# EAGLE design Laptimer (EAGLE 6.3)
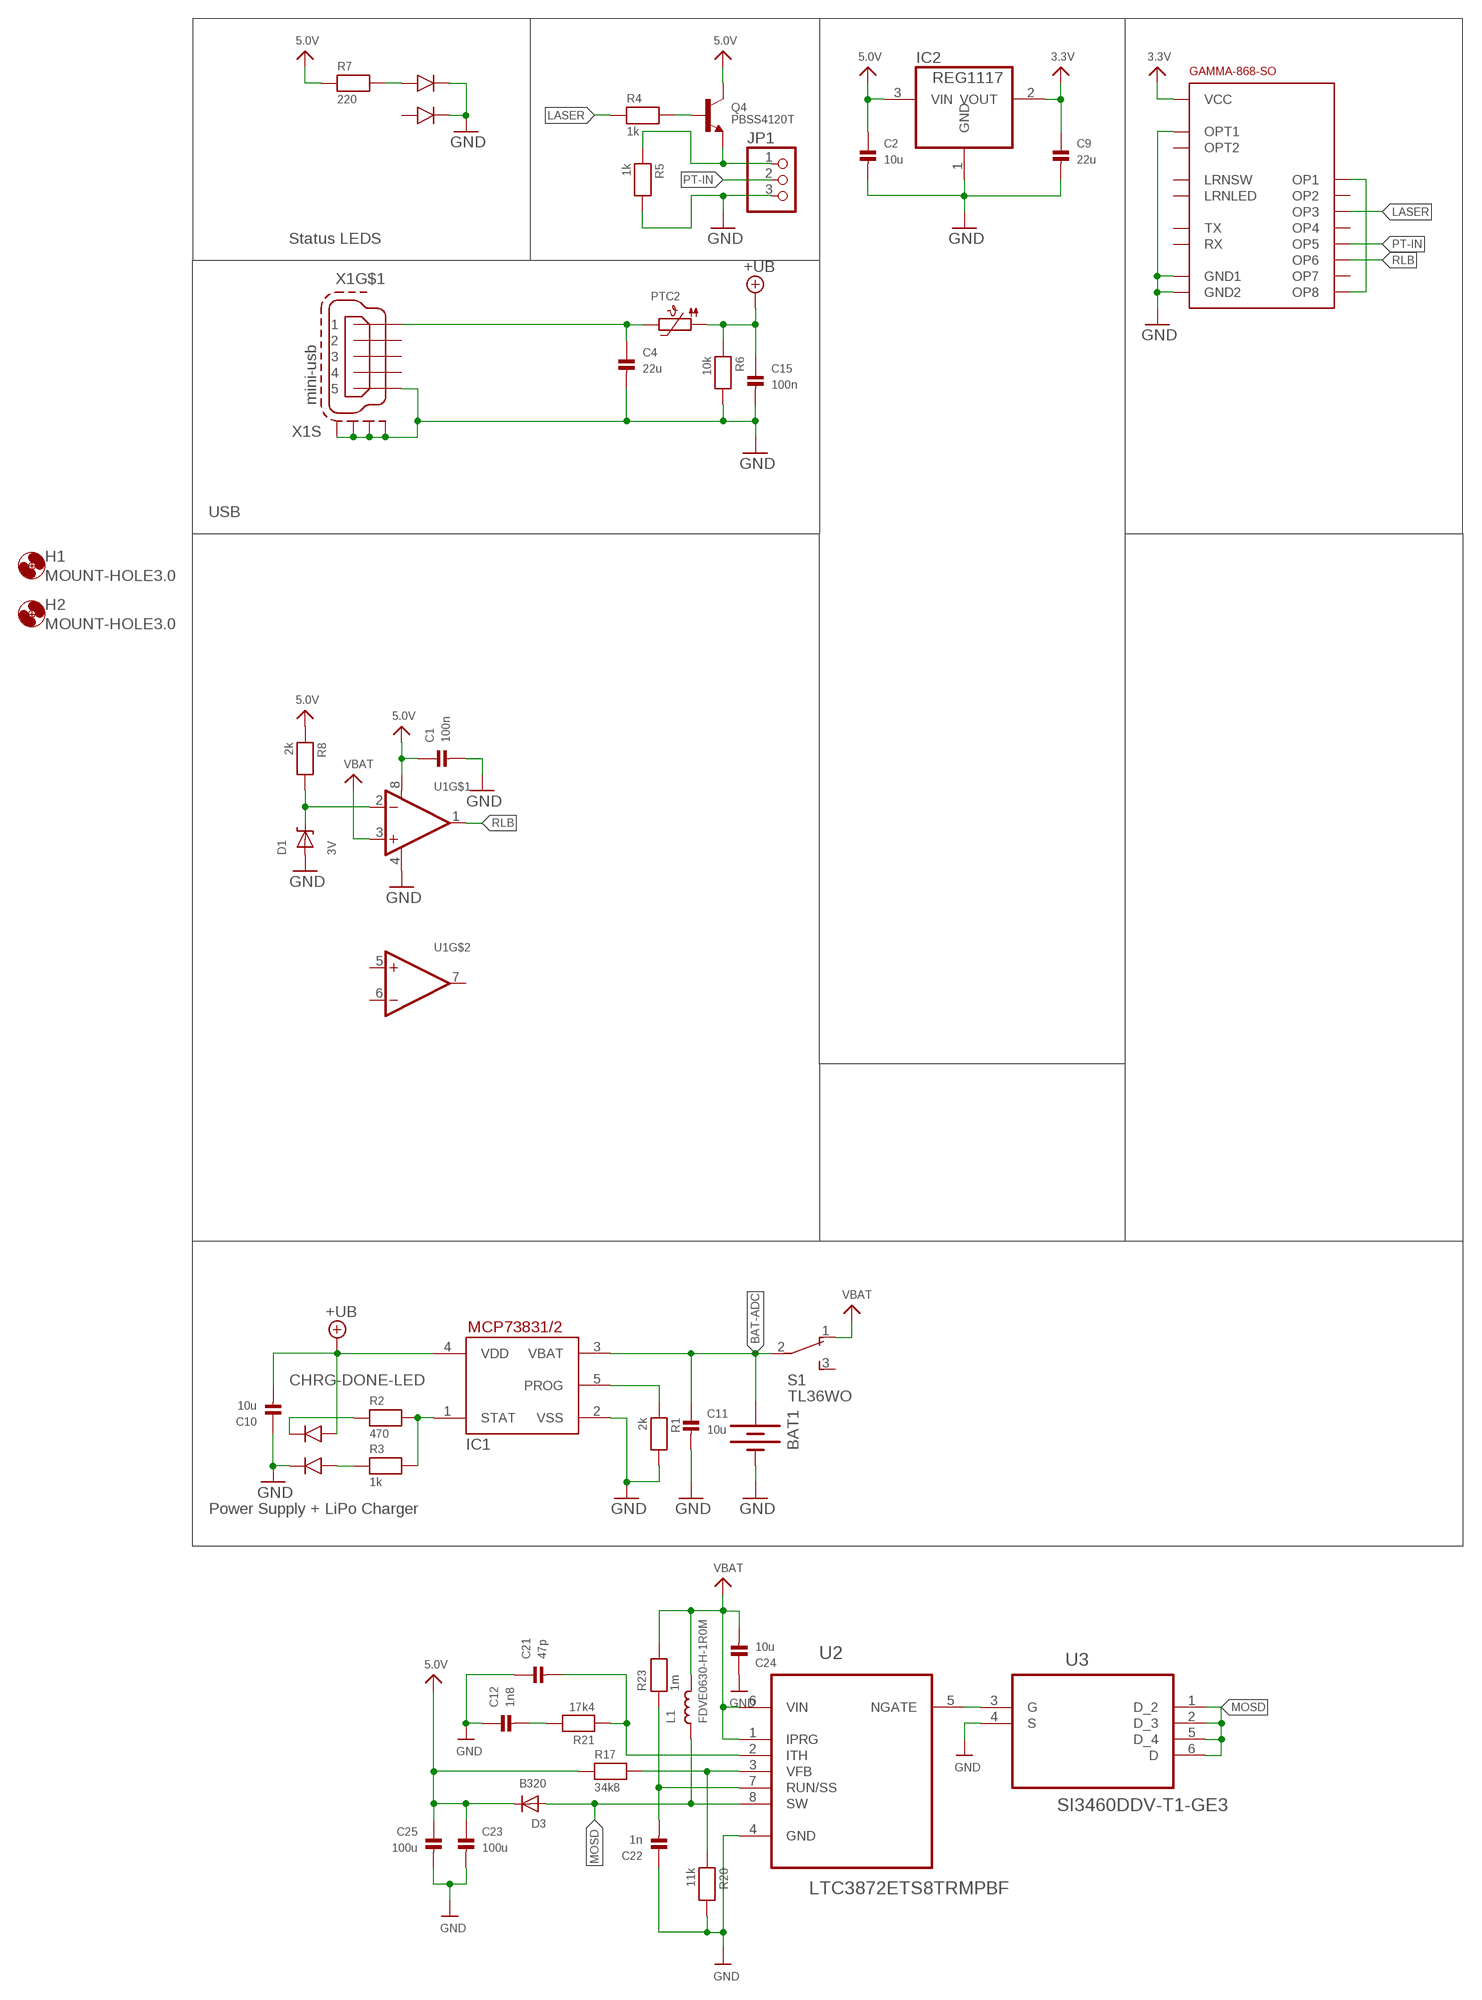
[diagram p0: schematic, sheet 1]

## Parts
BAT1  BATTERY18650  [BATTERY_18650-HOLDER]
C1  100n  CAP_CERAMIC_0603  [_0603]
C2  10u  CAP_CERAMIC_0805  [_0805]
C4  22u  CAP_CERAMIC_0805  [_0805]
C9  22u  CAP_CERAMIC_0805  [_0805]
C10  10u  CAP_CERAMIC_0805  [_0805]
C11  10u  CAP_CERAMIC_0805  [_0805]
C12  1n8  CAP_CERAMIC_0603  [_0603]
C15  100n  CAP_CERAMIC_0603  [_0603]
C21  47p  CAP_CERAMIC_0603  [_0603]
C22  1n  CAP_CERAMIC_0603  [_0603]
C23  100u  CAP_CERAMIC1206  [1206]
C24  10u  CAP_CERAMIC_0805  [_0805]
C25  100u  CAP_CERAMIC1206  [1206]
D1  3V  DIODE-ZENER  [SMADIODE]
D3  B320  DIODESMA  [SMADIODE]
H1  MOUNT-HOLE3.0  [3,0]
H2  MOUNT-HOLE3.0  [3,0]
IC1  MCP73831/OT  [SOT23-5L]
IC2  REG1117  [SOT223]
JP1  PINHD-1X3  [1X03]
L1  FDVE0630-H-1R0M  INDUCTORTDK_SLF6045  [INDUCTOR_6X6MM_TDK_SLF6045]
PTC2  PTC1206  [1206]
Q4  PBSS4120T  TRANSISTOR_NPNWIDE  [SOT23-WIDE]
R1  2k  RESISTOR_0603  [_0603]
R2  470  RESISTOR_0603  [_0603]
R3  1k  RESISTOR_0603  [_0603]
R4  1k  RESISTOR_0603  [_0603]
R5  1k  RESISTOR_0603  [_0603]
R6  10k  RESISTOR_0603  [_0603]
R7  220  RESISTOR_0603  [_0603]
R8  2k  RESISTOR_0603  [_0603]
R17  34k8  RESISTOR_0603  [_0603]
R20  11k  RESISTOR_0603  [_0603]
R21  17k4  RESISTOR_0603  [_0603]
R23  1m  RESISTOR_0603  [_0603]
S1  TL36WO  [TL3XWO]
U1  LM358  [SOIC8_150MIL]
U2  LTC3872ETS8TRMPBF  [SOT65P280X100-8N]
U3  SI3460DDV-T1-GE3  SI3457CDV-T1-GE3  [SOT95P285X110-6N]
U$7  GAMMA-868-SO  [UNICORN_V2_GAMMA-868-SO]
U$13  BI-LEVEL-LED-INDICATOR  [BI-LEVEL-LED-INDICATOR]
U$14  BI-LEVEL-LED-INDICATOR  [BI-LEVEL-LED-INDICATOR]
X1  mini-usb  MINI-USB-SCHIELD-32005-301  [32005-301]

## Nets
3.3V: C9.1 IC2.2(VOUT) U$7.P$16(VCC)
5.0V: C1.1 C2.1 C23.1 C25.1 D3.C IC2.3(VIN) Q4.3(C) R7.1 R8.1 R17.1 U1.8(V+)
+UB: C10.2 C15.1 IC1.4(VDD) PTC2.1 R6.1 U$13.ANODE1
BAT-ADC: BAT1.PWR@1(+) C11.1 IC1.3(VBAT) S1.2(P)
CHRG-DONE-LED: R3.1 U$13.ANODE2
CT: U$7.P$3(OP1) U$7.P$13(OP8)
GND: BAT1.GND@1(-) C1.2 C2.2 C4.2 C9.2 C10.1 C11.2 C12.1 C15.2 C21.1 C22.1 C23.2 C24.1 C25.2 D1.A IC1.2(VSS) IC2.1(GND) JP1.3 R1.2 R5.2 R6.2 R20.2 U1.4(V-) U2.4(GND) U3.4(S) U$7.P$2(GND1) U$7.P$10(OPT1) U$7.P$15(GND2) U$13.CATHODE2 U$14.CATHODE1 U$14.CATHODE2 X1.5 X1.M1(S:S1) X1.M2(S:S2) X1.M3(S:S3) X1.M4(S:S4)
LASER: R4.1 U$7.P$7(OP3)
MOSD: D3.A L1.P$1 U2.8(SW) U3.1(D_2) U3.2(D_3) U3.5(D_4) U3.6(D)
N$1: R17.2 R20.1 U2.3(VFB)
N$2: C12.2 R21.2
N$3: IC1.5(PROG) R1.1
N$4: IC1.1(STAT) R2.2 R3.2
N$5: JP1.1 Q4.2(E) R5.1
N$6: Q4.1(B) R4.2
N$7: D1.C R8.2 U1.2(-IN)
N$8: U2.5(NGATE) U3.3(G)
N$13: C4.1 PTC2.2 X1.1
N$14: R2.1 U$13.CATHODE1
N$27: C21.2 R21.1 U2.2(ITH)
N$29: C22.2 R23.1 U2.7(RUN/SS)
N$32: R7.2 U$14.ANODE2
PT-IN: JP1.2 U$7.P$9(OP5)
RLB: U1.1(OUT) U$7.P$11(OP6)
VBAT: C24.2 L1.P$2 R23.2 S1.1(O) U1.3(+IN) U2.1(IPRG) U2.6(VIN)
Unconnected: S1.3(S) U1.5(+IN) U1.6(-IN) U1.7(OUT) U$7.P$4(OP2) U$7.P$5(LRNSW) U$7.P$6(LRNLED) U$7.P$8(OP4) U$7.P$12(OP7) U$7.P$14(OPT2) U$7.P$17(TX) U$7.P$18(RX) U$14.ANODE1 X1.2 X1.3 X1.4

## Notes on the sheet
- Status LEDS
- USB
- Power Supply + LiPo Charger

## Library data of the parts
BAT1 = SparkFun-Electromechanical:BATTERY: Battery Holders Various common sizes : AA, AAA, 18650 (PRT-12895), 20mm coin cell and 12mm coin cell. 20MM_4LEGS, BATT-10373
C1 C2 C4 C9-C12 C15 C21-C25 = microbuilder:CAP_CERAMIC: Ceramic Capacitors 0402 - 0402 Surface Mount Capacitors 16pF 50V 5% [Digikey: 445-4899-2-ND] 18pF 50V 5% [Digikey: 490-1281-2-ND] 22pF 50V 5% [Digikey: 490-1283-2-ND] 68pF 50V 5% [Digikey: 490-1289-2-ND] 0.1uF 10V 10% [Digikey: 490-1318-2-ND] 1.0uF 6.3V 10% [Digikey: 490-1320-2-ND] 0603 - 0603 Surface Mount Capacitors 16 pF 50V 5% [Digikey: 445-5051-2-ND] 22 pF 50V [Digikey: PCC220ACVTR-ND] 33 pF 50V 5% [Digikey: 490-1415-1-ND] 56pF 50V 5% [Digikey: 490-1421-1-ND] 220pF 50V 5% [Digikey: 445-1285-1-ND] 680 pF 50V 2200 pF 50V 5% C0G [Digikey: 445-1297-1-ND] 5600 pF 100V 5% X7R [Digikey: 478-3711-1-ND] 0.1 µF 25V 10% [Digikey: PCC2277TR-ND] 0.22 µF 16V 10% X7R [Digikey: 445-1318-1-ND] 1.0 µF 25V 10% [Digikey: 445-5146-2-ND] 0603 - RF Specific 3pF 250V +/-0.1pF RF [Digikey: 712-1347-1-ND] 18 pF 250V 5% [Digikey: 478-3505-1-ND or 712-1322-1-ND] 56 pF 250V 5% C0G RF [Digikey: 490-4867-1-ND] 68 pF 250V RF [Digikey: 490-4868-1-ND] 0805 - 0805 Surface Mount Capacitors 220 pF 250V 2% RF Ceramic Capacitor [Digikey: 712-1398-1-ND] 1000 pF 50V 2% NP0 Ceramic Capacitor [Digikey: 478-3760-1-ND] 0.1 µF 25V 10% Ceramic Capacitor [Digikey: PCC1828TR-ND] 1.0 µF 16V 10% Ceramic Capacitor[Digikey: 490-1691-2-ND] 10.0 µF 10V 10% Ceramic Capacitor[Digikey: 709-1228-1-ND] 10.0 uF 16V 10% Ceramic Capacitor [Digikey: 478-5165-2-ND] 47 uF 6.3V 20% Ceramic Capacitor [Digikey: 587-1779-1-ND or 399-5506-1-ND] 1206 - 1206 Surface Mount Capacitors 47uF 10V 20% Ceramic Capacitor [Digikey: 490-5528-1-ND or 399-5508-1-ND or 445-6010-1-ND] 100uF 6.3V -20%, +80% Y5V Ceramic Capacitor (Digikey: 490-4512-1-ND, Mouser: 81-GRM31CF50J107ZE1L)
D1 = microbuilder:DIODE-ZENER: Zener Diode SMA: 30V 1W Zener Diode, 1.2Vf - Digikey: SMAZ30-FDICT-ND
D3 = adafruit:DIODE: Diode SMADIODE - SMA Surface Mount Package 20V 1A Schottky Diode Digikey: 641-1014-6-ND DO-1N4148 - Through Hole Small Current Diode SOD-123 20V 1 A (.5mV Vf) Schottky Diode - Digikey: MBRX120TPMSCT-ND SOD-323 10V 570mA (.38mV Vf, 3ns) Schottky Diode - Digikey: ZLLS410CT-ND SOD-523 30V 30mA Schottky Diode (RB751S-40TE61) - Digikey: RB751S-40TE61CT-ND SOT23-R/W - SOT23 Package (R = Solder Paste/Reflow Ovens, W = Hand-Soldering) BAT54Film 40V 300mA - Digikey: 497-7162-1-ND
H1 H2 = holes:MOUNT-HOLE: MOUNTING HOLE with drill center marker
IC1 = adafruit:MCP73831: MCP73831/2 Miniature Single-Cell, Fully Integrated Li-Ion, Li-Polymer Charge Management Controllers. Nice and small simple lipoly charge controller, with adjustable current and status output (LED) http://www.ladyada.net/library/pcb/eaglelibrary.html
IC2 = burr-brown:REG1117: 800mA and 1A Low Dropout (LDO) Positive Regulator 1.8V, 2.5V, 2.85V, 3.3V, 5V, and Adj; MPN: REG1117; OC_FARNELL: 1097566; OC_NEWARK: 14P6981
JP1 = adafruit:PINHD-1X3: PIN HEADER
L1 = microbuilder:INDUCTOR: Inductors 0603: 10nH Ceramic Inductor - microwire antenna/RF (Digikey: 712-1434-2-ND) 0805: 560nH Ceramic Inductor - RF (Digikey: 553-1047-1-ND) 270nH Ceramic Inductor - Q = 40@250MHz, +-5%, 1 Ohm DC Resistance (Digikey: 535-10506-2-ND) 1007 (2518 Metric) SMT: 10µH 10% 250mOhm 820mA 1007 Inductor (Digikey: 587-2189-1-ND) 22µH 10% 500mOhm 580mA 1007 Inductor (Digikey: 587-2190-1-ND) 47µH 10% 950mOhm 420mA 1007 Inductor (Digikey: 587-2191-1-ND) 47µH 5% 100mOhm 1A 1008 Inductor (Digikey: 732-1816-1-ND) 5.0x5.0mm (Taiyo Yuden NR5040 Series) 6.8µH 20% 2.3A 64mOhm Inductor (Digikey: 587-2374-2-ND) 5.0x5.0mm (TDK VLC5045 Series) 4.7µH 20% 3.3A 34mOhm Inductor (Digikey: 445-6526-1-ND) 6.8µH 20% 2.7A 46mOhm Inductor (Digikey: 445-6527-1-ND) 6.0x6.0mm (TDK VLC6045 Series) 4.7µH 20% 3.8A 27mOhm Inductor (Digikey: 445-6538-2-ND) 6.8µH 20% 3A 41mOhm Inductor (Digikey: 445-6540-1-ND) 6.2µH 30% 2.2A 45mOhm Inductor (Digikey: SRR5028-6R2YCT-ND) - Not TDK VLC6045 but footprint should match 6.0x6.0mm (TDK SLF6045 Series) 6.8uH 30% 2A 33mOhm Inductor (Digikey: 445-4572-1-ND, Mouser: 810-SLF645T6R8N2R0PF)
PTC2 = microbuilder:PTC: PTC (Resettable Fuse) 1206 Package 250mA PTC (16V Max, Time-to-Trip: 0.08s) - Digikey: F2110CT-ND 1210 Package 100mA PTC (30V Max, Time-to-Trip: 0.6s) - Digikey: MF-USMF010-2CT-ND 1812 Package 750mA PTC (24V Max, Time-to-Trip: 0.2s) - Digikey: MF-MSMF075/24-2CT-ND
Q4 = microbuilder:TRANSISTOR_NPN: NPN Transistor Transistor (NPN) 500mA 45V - BC817 [Digikey: 568-1631-1-ND] Transistor (NPN) 500mA 45V - BC817,215 [Mouser: 771-BC817-T/R] SOT23-R - SOT23 footprint optimised for use with solder paste and reflow ovens. SOT23-W - SOT23 footprint optimised for hand-soldering (larger pads).
R1-R8 R17 R20 R21 R23 = microbuilder:RESISTOR: Resistors 0402 - 0402 Surface Mount Package 22 Ohm 1% 1/16W [Digikey: 311-22.0LRTR-ND] 33 Ohm 5% 1/16W 1.0K 5% 1/16W 1.5K 5% 1/16W 2.0K 1% 1/16W 10.0K 1% 1/16W [Digikey: 311-10.0KLRTR-ND] 10.0K 5% 1/16W [Digikey: RMCF0402JT10K0TR-ND] 12.1K 1% 1/16W [Digikey: 311-22.0LRTR-ND] 100.0K 5% 1/16W 0603 - 0603 Surface Mount Package 0 Ohm 1/10 Watt 1% Resistor 15 Ohm 1/10 Watt 1% Resistor 33 Ohm 1/10 Watt 1% Resistor 49.9 Ohm 1/10 Watt 1% Resistor 100 Ohm 1/10 Watt 1% Resistor 150 Ohm 1/10 Watt 1% Resistor 240 Ohm 1/10 Watt 1% Resistor 390 Ohm 1/10 Watt 1% Resistor 560 Ohm 1/10 Watt 1% Resistor 680 Ohm 1/10 Watt 1% Resistor 750 Ohm 1/10 Watt 1% Resistor 1.0K Ohm 1/10 Watt 1% Resistor 1.5K Ohm 1/10 Watt 1% Resistor 2.0K Ohm 1/10 Watt 1% Resistor 2.2K Ohm 1/10 Watt 1% Resistor 3.3K Ohm 1/10 Watt 1% Resistor 4.7K Ohm 1/10 Watt 1% Resistor 10.0K Ohm 1/10 Watt 1% Resistor 12.0K Ohm 1/10 Watt 1% Resistor 12.1K Ohm 1/10 Watt 1% Resistor 20.0K Ohm 1/10 Watt 1% Resistor 33.0K Ohm 1/10 Watt 1% Resistor 100.0K Ohm 1/10 Watt 1% Resistor 0805 - 0805 Surface Mount Package 0 Ohm 1/8 Watt 1% Resistor 33 Ohm 1/8 Watt 1% Resistor 100 Ohm 1/8 Watt 1% Resistor 150 Ohm 1/8 Watt 1% Resistor 200 Ohm 1/8 Watt 1% Resistor 240 Ohm 1/8 Watt 1% Resistor 330 Ohm 1/8 Watt 1% Resistor 390 Ohm 1/8 Watt 1% Resistor 470 Ohm 1/8 Watt 1% Resistor 1.0K Ohm 1/8 Watt 1% Resistor 1.5K Ohm 1/8 Watt 1% Resistor 2.0K Ohm 1/8 Watt 1% Resistor 4.7K Ohm 1/8 Watt 1% Resistor 5.1K Ohm 1/8 Watt 1% Resistor 5.6K Ohm 1/8 Watt 1% Resistor 10.0K Ohm 1/8 Watt 1% Resistor 22.0K Ohm 1/8 Watt 1% Resistor 33.0K Ohm 1/8 Watt 1% Resistor 100K Ohm 1/8 Watt 1% Resistor 1206 - 1206 Surface Mount Package 2012 - 2010 Surface Mount Package 0.11 Ohm 1/2 Watt 1% Resistor - Digikey: RHM.11UCT-ND
S1 = switch:TL36WO: TINY SWITCH ON - ON Source: http://www2.produktinfo.conrad.com/datenblaetter/700000-724999/705152-da-01-de-Subminiaturschalter_TL_36WO.pdf
U1 = microbuilder:LM358: LM358 Dual Operational Amplifier Digikey: LM358AMXFSCT-ND
U2 = LTC_By_element14_Batch_1:LTC3872ETS8TRMPBF: DC/DC Controller; MPN: LTC3872ETS8#TRMPBF; OC_FARNELL: 1556409; OC_NEWARK: 56M8617; PACKAGE: SOT-23-8; SUPPLIER: LINEAR TECHNOLOGY
U3 = Vishay_By_element14_Batch_1:SI3457CDV-T1-GE3: N-Channel 30-V (D-S) MOSFET; MPN: SI3457CDV-T1-GE3; OC_FARNELL: 1840420; OC_NEWARK: 90R9127; PACKAGE: TSOP-6; SUPPLIER: Vishay Siliconix
U$7 = unicorn_v2:GAMMA-868-SO
U$13 U$14 = unicorn_v2:BI-LEVEL-LED-INDICATOR
X1 = con-cypressindustries:MINI-USB-SCHIELD-: MINI USB-B Conector Source: www.cypressindustries.com; OC_FARNELL: unknown; OC_NEWARK: unknown

## Board
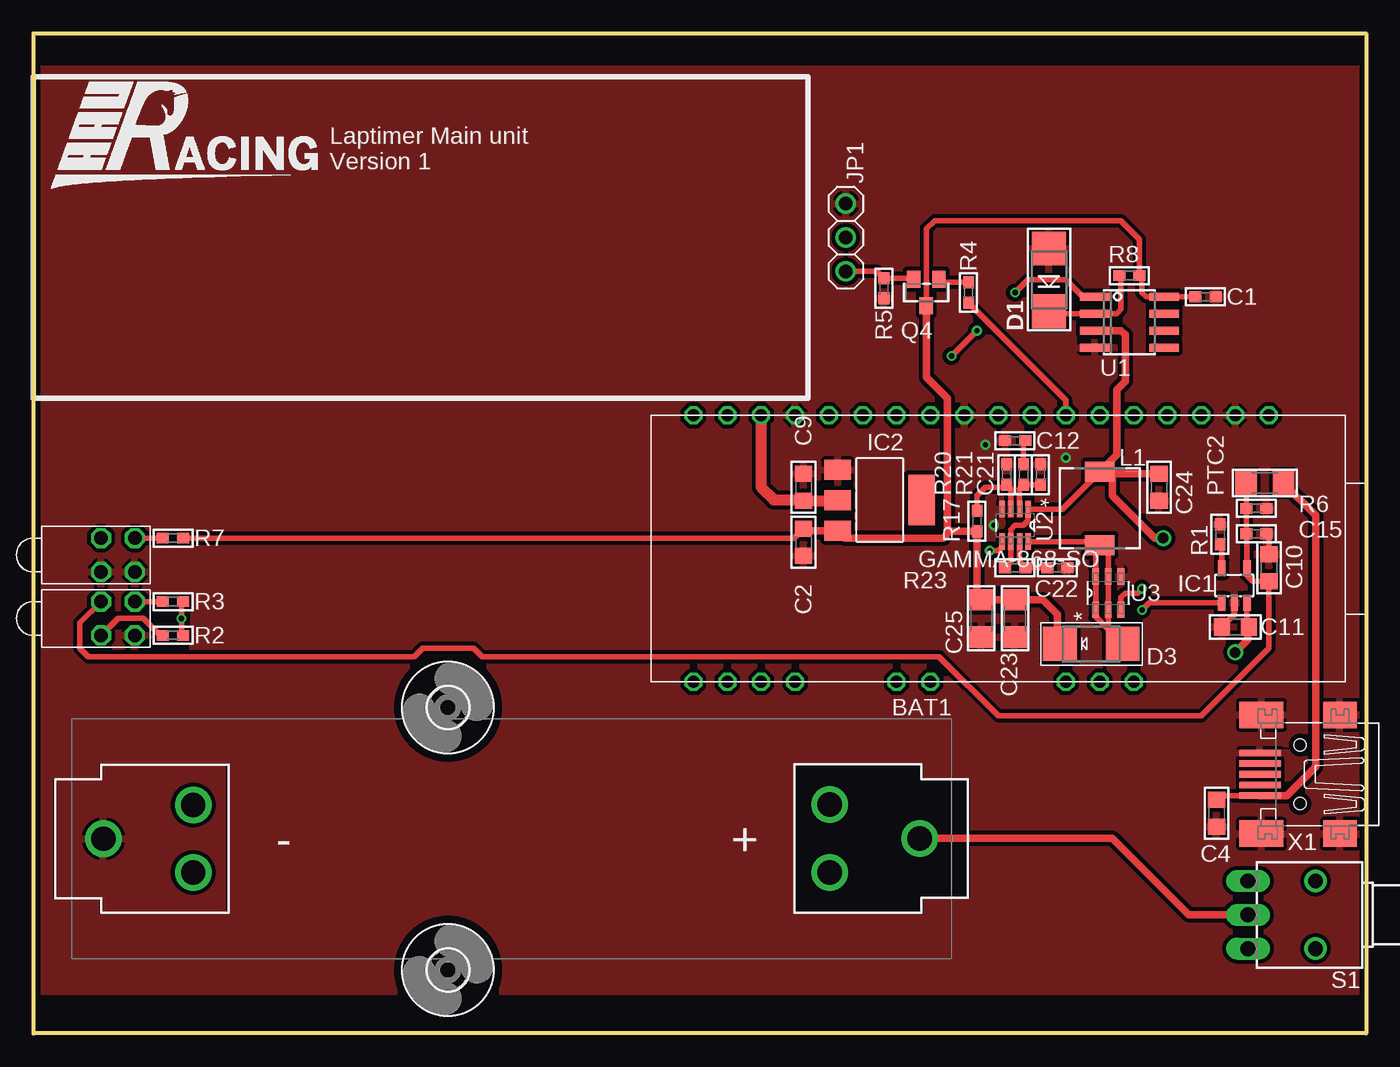
[diagram p1: board, top side]
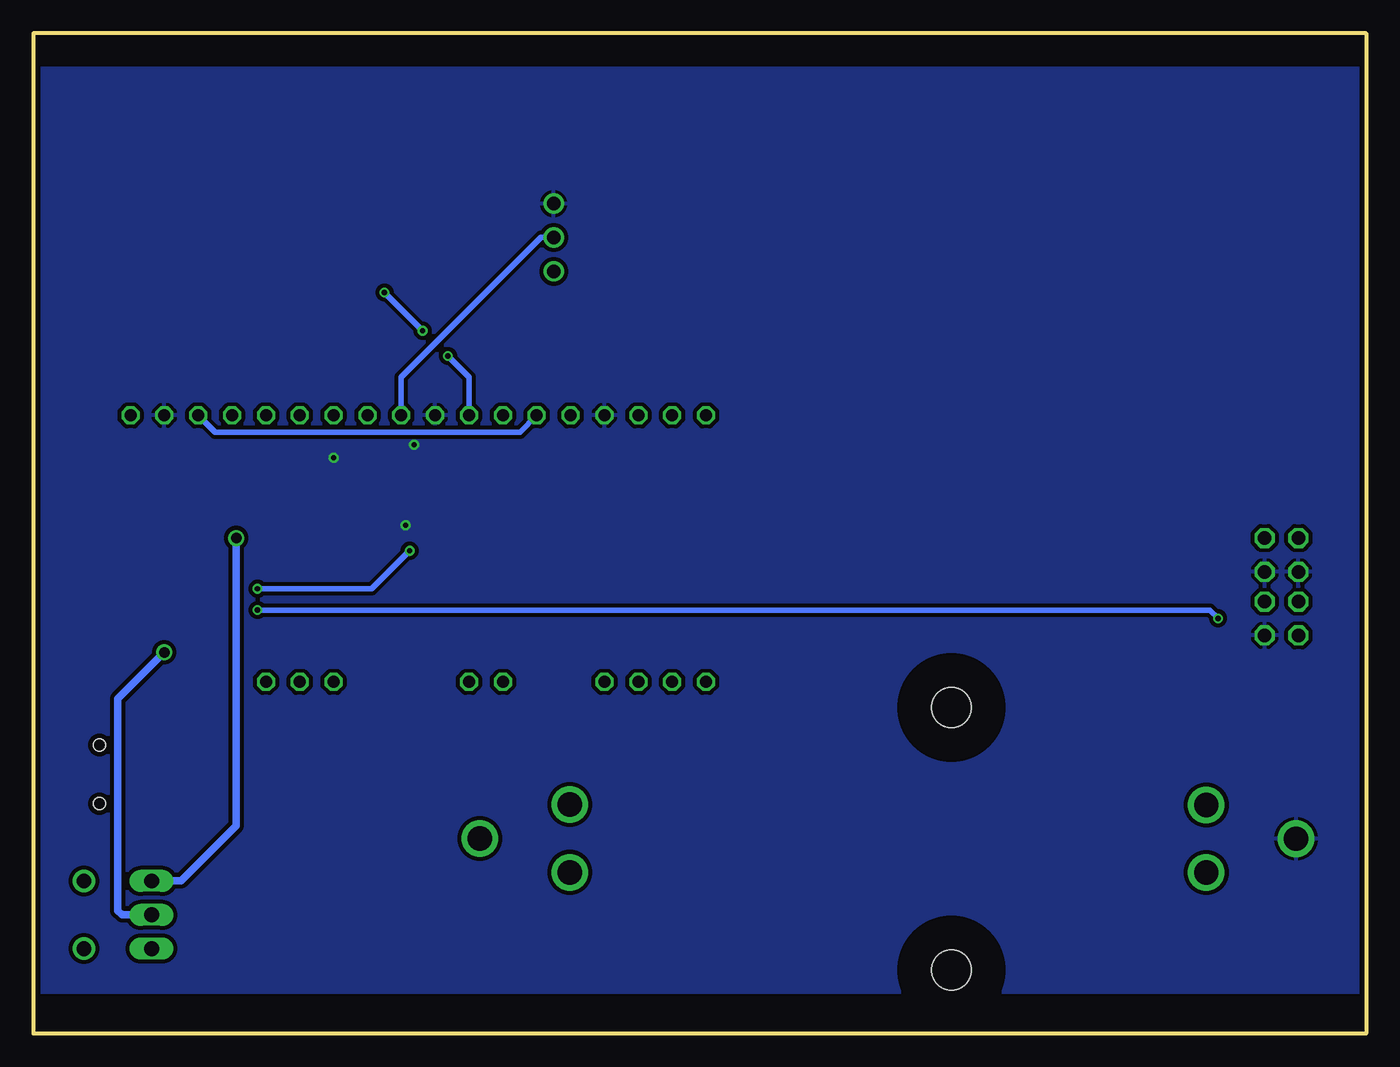
[diagram p2: board, bottom side, seen from below]

Size 100 x 75 mm. Coordinates in mm from the lower left corner, seen from the top.
Outline: 0,75 100,75 100,0 0,0 0,75
Copper layers (1*16): Top 0.0356mm / dielectric 1.5011mm / Bottom 0.0356mm
Design rules "LaenPCBOrder *": minimum track width 6mil, minimum drill 13mil, track to track 12mil, track to pad 12mil, pad to pad 12mil, via to via 12mil, smd to smd 12mil, copper to edge 15mil, drill to drill 6mil, minimum pad ring 7mil, minimum via ring 7mil, stop-mask expansion 3mil, vias tented up to drill 0mil, thermal gap 10mil

### Footprints (pad centres in the part's own frame; a part is rotated, then mirrored left to right if it is on the bottom)
BATTERY_18650-HOLDER = drill 1.829: GND@1 30.628,0.01; GND@2 23.88,2.55; GND@3 23.88,-2.53; PWR@1 -30.628,-0.01; PWR@2 -23.88,2.53; PWR@3 -23.88,-2.55
_0603 = smd 0.9 x 0.8: 1 -0.762,0; 2 0.762,0
_0805 = smd 1.2 x 1.3: 1 -1.016,0; 2 1.016,0
1206 = smd 1.6 x 1.8: 1 -1.4,0; 2 1.4,0
SMADIODE = smd 2.54 x 2.54: A 2.349,0; C -2.349,0
3,0 = hole 3: 0,0
SOT23-5L = smd 0.55 x 1.2: 1 -0.95,-1.3; 2 0,-1.3; 3 0.95,-1.3; 4 0.95,1.3; 5 -0.95,1.3
SOT223 = smd 1.499 x 2.007: 1 -2.261,-3.15; 2 0.025,-3.15; 3 2.311,-3.15 | smd 3.81 x 2.007: 4 0,3.15
1X03 = drill 1.016: 1 -2.54,0; 2 0,0; 3 2.54,0
INDUCTOR_6X6MM_TDK_SLF6045 = smd 1.5 x 2.2: P$1 -2.75,0; P$2 2.75,0
SOT23-WIDE = smd 1 x 1.27: 1 -0.95,-1; 2 0.95,-1; 3 0,1
TL3XWO = drill 1.1 pad 1.422 long: 1 -2.54,-5.08; 2 0,-5.08; 3 2.54,-5.08 | drill 1.1 pad 1.676: M1 -2.54,0; M2 2.54,0
SOIC8_150MIL = smd 0.6 x 2.2: 1 -1.905,-2.6; 2 -0.635,-2.6; 3 0.635,-2.6; 4 1.905,-2.6; 5 1.905,2.6; 6 0.635,2.6; 7 -0.635,2.6; 8 -1.905,2.6
SOT65P280X100-8N = smd 1.219 x 0.406: 1 -1.219,0.965; 2 -1.219,0.33; 3 -1.219,-0.33; 4 -1.219,-0.965; 5 1.219,-0.965; 6 1.219,-0.33; 7 1.219,0.33; 8 1.219,0.965
SOT95P285X110-6N = smd 1.219 x 0.508: 1 -1.245,0.94; 2 -1.245,0; 3 -1.245,-0.94; 4 1.245,-0.94; 5 1.245,0; 6 1.245,0.94
UNICORN_V2_GAMMA-868-SO = drill 0.9 octagon: P$1 0,0; P$2 2.54,0; P$3 5.08,0; P$4 7.62,0; P$5 10.16,0; P$6 12.7,0; P$7 15.24,0; P$8 17.78,0; P$9 20.32,0; P$10 22.86,0; P$11 25.4,0; P$12 27.94,0; P$13 30.48,0; P$14 33.02,0; P$15 35.56,0; P$16 38.1,0; P$17 40.64,0; P$18 43.18,0; P$19 43.18,20.003; P$20 40.64,20.003; P$21 38.1,20.003; P$22 35.56,20.003; P$23 27.94,20.003; P$24 25.4,20.003; P$25 15.24,20.003; P$26 12.7,20.003; P$27 10.16,20.003
BI-LEVEL-LED-INDICATOR = drill 1 octagon: ANODE1 1.27,1.27; ANODE2 1.27,-1.27; CATHODE1 -1.27,1.27; CATHODE2 -1.27,-1.27
32005-301 = smd 3.1 x 0.5: 1 3,1.6; 2 3,0.8; 3 3,0; 4 3,-0.8; 5 3,-1.6 | smd 2.5 x 2: M1 -3,-4.45; M2 -3,4.45 | smd 3.3 x 2: M3 2.9,4.45; M4 2.9,-4.45 | hole 0.9: 0,2.2; 0,-2.2

### Placement (x,y rotation side)
BAT1  35.88,14.61 180 top
C1  87.95,55.24 0 top
C2  57.78,36.83 270 top
C4  88.77,16.51 270 top
C9  57.78,40.96 90 top
C10  92.71,34.92 270 top
C11  90.17,30.48 180 top
C12  73.66,44.45 0 top
C15  91.76,37.47 0 top
C21  75.56,41.91 270 top
C22  76.83,34.92 180 top
C23  73.66,31.11 270 top
C24  84.45,40.96 90 top
C25  71.12,31.11 270 top
D1  76.2,56.52 90 top
D3  79.38,29.21 0 top
H1  31.11,24.45 0 top
H2  31.11,4.76 0 top
IC1  90.11,33.58 0 top
IC2  63.5,40.01 270 top
JP1  60.96,59.69 90 top
L1  80.01,39.37 90 top
PTC2  92.39,41.27 0 top
Q4  66.99,55.56 180 top
R1  89.03,37.43 90 top
R2  10.48,29.84 0 top
R3  10.48,32.38 0 top
R4  70.17,55.56 90 top
R5  63.82,55.88 270 top
R6  91.76,39.37 0 top
R7  10.48,37.15 180 top
R8  82.23,56.83 180 top
R17  70.8,38.42 90 top
R20  73.03,41.91 90 top
R21  74.3,41.91 90 top
R23  73.66,34.92 180 top
S1  96.2,8.89 270 top
U1  82.23,53.34 270 top
U2  73.66,38.1 270 top
U3  80.64,33.02 90 top
U$7  92.71,46.35 180 top
U$13  6.35,31.11 90 top
U$14  6.35,35.88 90 top
X1  95.03,19.43 180 top

### Tracks (layer width: path | path; a pad name or v marks a point on that pad's centre or on a via)
3.3V
  Top 0.813: U$7.P$16 54.61,40.96 55.56,40.01 57.72,40.01 C9.1 60.31,39.94 IC2.2
5.0V
  Top 0.406: Q4.3 66.99,60.33 67.63,60.96 81.6,60.96 83,59.56 R8.1 83.19,56.64 83.19,55.56 83.5,55.24 U1.8 C1.1 | R7.1 57.09,37.15 C2.1
  Top 0.559: Q4.3 66.99,49.21 68.58,47.62 68.58,37.47 | 68.58,37.47 68.26,37.15 60.9,37.15 IC2.3 57.94,37.69 C2.1 | 68.58,37.47 68.77,37.66 R17.1 70.8,32.83 C25.1 C23.1 75.75,32.52 76.83,31.43 76.83,29.4 D3.C
+UB
  Top 0.406: PTC2.1 R6.1 C15.1 91.06,37.4 IC1.4 91.12,34.82 91.12,34.29 91.5,33.91 C10.2 92.71,28.89 87.63,23.81 72.39,23.81 67.94,28.26 33.66,28.26 33.02,28.89 29.21,28.89 28.57,28.26 4.13,28.26 3.49,28.89 3.49,30.8 U$13.ANODE1
BAT-ADC  (via drill 0.8)
  Top 0.406: IC1.3 91.06,30.61 C11.1
  Top 0.559: BAT1.PWR@1 80.95,14.62 86.68,8.89 S1.2 | v90.17,28.57 91.12,29.53 91.12,30.42 C11.1
  Bottom 0.559: S1.2 93.34,8.89 93.66,9.21 93.66,25.08 v90.17,28.57
CHRG-DONE-LED
  Top 0.406: R3.1 U$13.ANODE2
CT
  Bottom 0.406: U$7.P$13 63.5,45.09 86.36,45.09 U$7.P$3
GND  (via drill 0.38)
  Top 0.406: C10.1 92.71,37.27 C15.2 | IC1.2 90.11,31.43 C11.2
  other vias: 71.44,44.13 77.47,43.18 72.07,38.1
  pour Top: 0,72.33 100.14,72.33 100.14,3.12 0.13,3.12
  pour Bottom: 0,72.33 100.14,72.33 100.14,3.12 0.13,3.12
LASER
  Top 0.406: U$7.P$7 77.47,47.5 R4.1
MOSD
  Top 0.406: U2.8 79.75,36.88 L1.P$1 | U3.6 79.7,36.31 L1.P$1 | L1.P$1 80.22,36.83 80.64,36.83 U3.5 U3.2 80.64,30.29 | 80.64,30.29 D3.A | 80.64,30.29 79.7,31.23 U3.1 79.7,34.28 79.69,34.29
N$1
  Top 0.406: U2.3 73.33,40.84 R20.1 72.83,40.96 71.44,40.96 70.8,40.32 R17.2
N$2
  Top 0.406: R21.2 74.3,44.32 C12.2
N$3
  Top 0.406: IC1.5 89.16,36.55 R1.1
N$4  (via drill 0.38)
  Top 0.406: IC1.1 83.72,32.28 v83.19,31.75 | R2.2 11.11,29.97 v11.11,31.11 11.11,32.38 R3.2
  Bottom 0.406: v83.19,31.75 11.75,31.75 v11.11,31.11
N$5
  Top 0.406: JP1.1 63.31,57.15 R5.1 65.96,56.64 Q4.2
N$6
  Top 0.406: R4.2 68.18,56.33 Q4.1
N$7
  Top 0.406: R8.2 81.6,56.71 81.6,54.29 81.28,53.98 U1.2 76.39,53.98 D1.C
N$8  (via drill 0.38)
  Top 0.406: U3.3 81.58,32.69 81.92,33.02 82.87,33.02 v83.19,33.34 | v71.75,36.2 72.39,36.2 72.71,36.51 72.71,36.87 U2.5
  Bottom 0.406: v83.19,33.34 74.61,33.34 v71.75,36.2
N$13
  Top 0.406: X1.1 88.77,17.83 C4.1
  Top 0.559: X1.1 94.03,17.83 96.2,20 96.2,38.87 PTC2.2
N$14
  Top 0.406: R2.1 9.53,29.84 8.26,31.11 6.35,31.11 U$13.CATHODE1
N$27
  Top 0.406: U2.2 73.99,40.84 R21.1 C21.2
N$29
  Top 0.406: U2.7 73.99,35.36 R23.1 C22.2
N$32
  Top 0.406: U$14.ANODE2 R7.2
PT-IN
  Bottom 0.406: U$7.P$9 72.39,49.21 61.91,59.69 JP1.2
RLB  (via drill 0.38)
  Top 0.406: U1.1 78.74,55.24 77.47,56.52 74.61,56.52 v73.66,55.56 | v70.8,52.7 v68.9,50.8
  Bottom 0.406: v73.66,55.56 v70.8,52.7 | v68.9,50.8 67.31,49.21 U$7.P$11
VBAT  (via drill 0.8)
  Top 0.406: R23.2 73.33,35.36 U2.6 73.33,37.77 73.66,38.1 74.3,38.1 74.62,38.43 U2.1 77.21,39.32 L1.P$2
  Top 0.559: U1.3 81.6,52.7 81.92,52.39 81.92,48.9 81.28,48.26 81.28,43.39 L1.P$2 80.16,41.97 80.64,41.97 | C24.2 80.64,41.97 | v84.77,37.15 84.14,37.15 80.96,40.32 80.96,41.66 80.64,41.97
  Bottom 0.559: S1.1 88.9,11.43 84.77,15.56 v84.77,37.15

### Text on the board
tSilk: Laptimer Main unit / Version 1